# Altium schematic sheet PowerOld.SchDoc
size A4; Organization: Altium Limited; Address1: L3, 12a Rodborough Rd; Address2: Frenchs Forest; Address3: NSW; Address4: Australia 2086
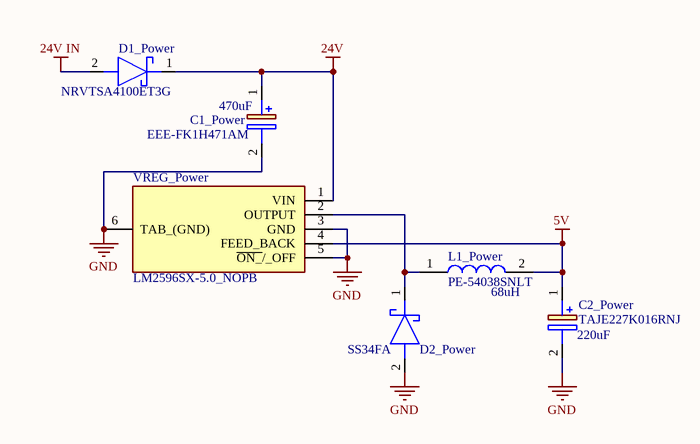
[diagram p0: PowerOld.SchDoc]

## Parts
C1_Power  EEE-FK1H471AM  value 470uF  [CAPAE1700X1700N]
C2_Power  TAJE227K016RNJ  value 220uF  [CAPPM7344X430N]
D1_Power  NRVTSA4100ET3G  [DIOM5226X220N]
D2_Power  SS34FA  [SODFL3618X143N]
L1_Power  PE-54038SNLT  value 68uH  [HCI-68]
VREG_Power  LM2596SX-5.0_NOPB  [KTT0005B]

## Nets
5V: C2_Power.1(+) L1_Power.2 VREG_Power.4(FEED_BACK)
24V: C1_Power.1(+) D1_Power.1(K) VREG_Power.1(VIN)
24V IN: D1_Power.2(A)
GND: C1_Power.2(-) C2_Power.2(-) D2_Power.2(A) VREG_Power.3(GND) VREG_Power.5(~{ON_}/_OFF) VREG_Power.6(TAB_(GND))
NetD2_Power_1: D2_Power.1(K) L1_Power.1 VREG_Power.2(OUTPUT)

## Notes on the sheet
- Title
- Size:
- Date:
- A4
- Number:
- Time:
- Revision:
- Sheet
- of
- File:

## Library data of the parts
C1_Power = EEE-FK1H471AM: Capacitor Polarised; Manufacturer_Name: Panasonic; Allied_Number: 70258116; Datasheet Link: https://industrial.panasonic.com/cdbs/www-data/pdf/RDE0000/ABA0000C1178.pdf; Height: 17mm; Manufacturer_Part_Number: EEE-FK1H471AM; Mouser Part Number: 667-EEE-FK1H471AM; Mouser Price/Stock: https://www.mouser.com/Search/Refine.aspx?Keyword=667-EEE-FK1H471AM; Allied Price/Stock: https://www.alliedelec.com/panasonic-eee-fk1h471am/70258116/
C2_Power = TAJE227K016RNJ: Capacitor Polarised; Manufacturer_Name: AVX; Allied_Number: 70475119; Datasheet Link: http://datasheets.avx.com/TAJ.pdf; Height: 4.3mm; Manufacturer_Part_Number: TAJE227K016RNJ; Mouser Part Number: 581-TAJE227K016R; Mouser Price/Stock: https://www.mouser.com/Search/Refine.aspx?Keyword=581-TAJE227K016R; RS Part Number: 1355452P; RS Price/Stock: http://uk.rs-online.com/web/p/products/1355452P; Allied Price/Stock: https://www.alliedelec.com/avx-taje227k016rnj/70475119/
D1_Power = NRVTSA4100ET3G: Schottky Diode; Manufacturer_Name: ON Semiconductor; Datasheet Link: http://www.onsemi.com/pub/Collateral/NRVTSA4100E-D.PDF; Height: 2.2mm; Manufacturer_Part_Number: NRVTSA4100ET3G; Mouser Part Number: 863-NRVTSA4100ET3G; Mouser Price/Stock: https://www.mouser.com/Search/Refine.aspx?Keyword=863-NRVTSA4100ET3G; RS Part Number: 1413561P; RS Price/Stock: http://uk.rs-online.com/web/p/products/1413561P
D2_Power = SS34FA: Schottky Diode; Manufacturer_Name: ON Semiconductor; Datasheet Link: http://www.onsemi.com/pub/Collateral/SS36FA-D.pdf; Height: 1.43mm; Manufacturer_Part_Number: SS34FA; Mouser Part Number: 512-SS34FA; Mouser Price/Stock: https://www.mouser.com/Search/Refine.aspx?Keyword=512-SS34FA; RS Part Number: 1841417; RS Price/Stock: http://uk.rs-online.com/web/p/products/1841417
L1_Power = PE-54038SNLT: Inductor; Manufacturer_Name: Pulse; Datasheet Link: https://productfinder.pulseeng.com/products/datasheets/SPM2007_47.pdf; Manufacturer_Part_Number: PE-54038SNLT; Mouser Part Number: 673-PE-54038SNLT; Mouser Price/Stock: https://www.mouser.com/Search/Refine.aspx?Keyword=673-PE-54038SNLT; RS Part Number: 7428262; RS Price/Stock: https://uk.rs-online.com/web/p/products/7428262
VREG_Power = LM2596SX-5.0_NOPB: Integrated Circuit; Manufacturer_Name: Texas Instruments; Manufacturer_Part_Number: LM2596SX-5.0/NOPB; Datasheet Link: http://www.ti.com/lit/gpn/lm2596; Mouser Part Number: 926-LM2596SX-5.0NOPB; Mouser Price/Stock: https://www.mouser.com/Search/Refine.aspx?Keyword=926-LM2596SX-5.0NOPB